# EAGLE schematic 8w_usb_soldering_iron (EAGLE 7.5.0)
CNAME: USB 8W Soldering Iron; CREVISION: 1.0; DESIGNER: RE by drubicza
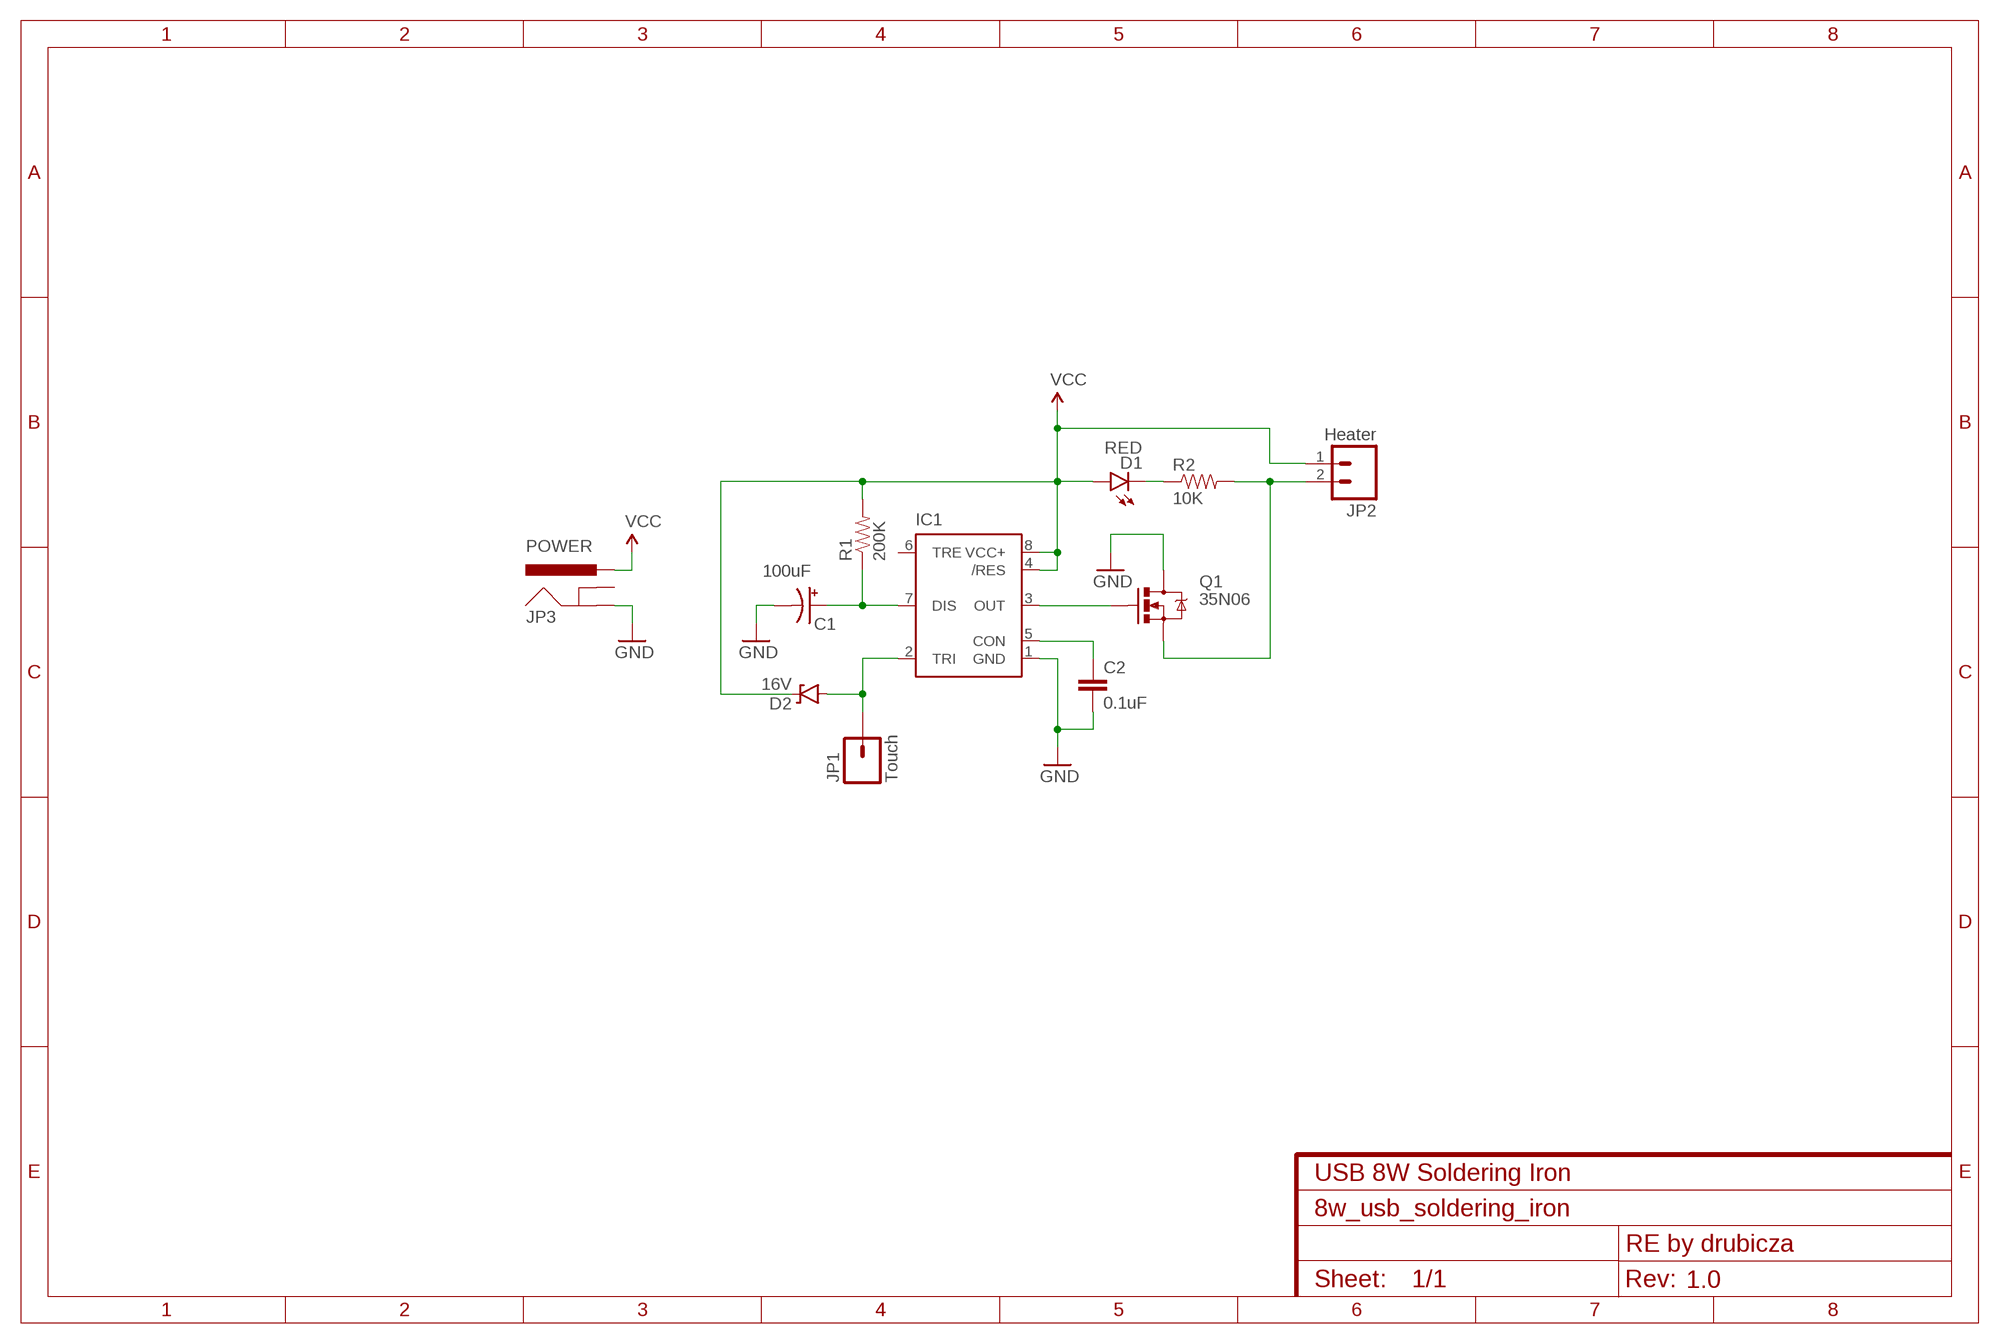
[diagram p0: schematic, sheet 1]

## Parts
C1  100uF  CAP_POLPTH1  [CPOL-RADIAL-100UF-25V]
C2  0.1uF  CAP0805  [0805]
D1  RED  LED3MM  [LED3MM]
D2  16V  DIODE-ZENER16V  [SOD-123]
IC1  NE555D  [SO08]
JP1  Touch  M01PTH  [1X01]
JP2  Heater  M02PTH  [1X02]
JP3  POWER  POWER_JACKPTH  [POWER_JACK_PTH]
Q1  35N06  MOSFET-NCHANNELFQP30N06L  [TO220V]
R1  200K  RESISTOR0603-RES  [0603-RES]
R2  10K  RESISTOR0603-RES  [0603-RES]

## Nets
GND: C1.2(-) C2.2 IC1.1(GND) JP3.GND Q1.2(D)
N$1: IC1.3(OUT) Q1.1(G)
N$2: C1.1(+) IC1.7(DIS) R1.1
N$3: D1.K(C) R2.1
N$4: C2.1 IC1.5(CON)
N$5: JP2.2 Q1.3(S) R2.2
N$7: D2.A IC1.2(TRI) JP1.1
VCC: D1.A D2.C IC1.4(/RES) IC1.8(VCC+) JP2.1 JP3.PWR R1.2
Unconnected: IC1.6(TRE) JP3.GNDBREAK

## Library data of the parts
C1 = SparkFun-Passives:CAP_POL: Capacitor Polarized These are standard SMD and PTH capacitors. Normally 10uF, 47uF, and 100uF in electrolytic and tantalum varieties. Always verify the external diameter of the through hole cap, it varies with capacity, voltage, and manufacturer. The EIA devices should be standard.
C2 = SparkFun-Passives:CAP: Capacitor Standard 0603 ceramic capacitor, and 0.1" leaded capacitor.
D1 = SparkFun-LED:LED: LEDs Standard schematic elements and footprints for 5mm, 3mm, 1206, and 0603 sized LEDs. 5mm - Spark Fun Electronics SKU : COM-00529 (and others)
D2 = SparkFun-DiscreteSemi:DIODE-ZENER: Zener Diode Production Part - 8199 3.4V Zener Voltage; PROD_ID: DIO-12440
IC1 = SparkFun-AnalogIC:NE555: General purpose bipolar Timer
JP1 = SparkFun-Connectors:M01: Header 1 Standard 1-pin 0.1" header. Use with straight break away headers (SKU : PRT-00116), right angle break away headers (PRT-00553), swiss pins (PRT-00743), machine pins (PRT-00117), and female headers (PRT-00115).
JP2 = SparkFun-Connectors:M02: Standard 2-pin 0.1" header. Use with - straight break away headers ( PRT-00116) - right angle break away headers (PRT-00553) - swiss pins (PRT-00743) - machine pins (PRT-00117) - female headers (PRT-00115) Molex polarized connector foot print use with: PRT-08233 with associated crimp pins and housings. 2.54_SCREWTERM for use with PRT-10571. 3.5mm Screw Terminal footprints for PRT-08084 5mm Screw Terminal footprints for use with PRT-08432
JP3 = SparkFun-Connectors:POWER_JACK: Power Jack This is the standard 5.5mm barrel jack for power. The PTH is the most common, proven, reliable, footprint. The Slot footprint only works if the mill layer is transmitted to the PCB fab house so be warned. Mating wall wart : TOL-00298 (and others); PROD_ID: CONN-08197
Q1 = SparkFun-DiscreteSemi:MOSFET-NCHANNEL: Common NMOSFET Parts MFG P/N Store ID Prod ID FDD8780 TRANS-09984 SI7820DN TRANS-11055 FDS6630A IC-08089 2N7002PW TRANS-11151 FQP30N06L COM-10213 TRANS-10060 BSS123LT1G TRANS-08345 BSS138 TRANS-00830 BS170 2N7000; PROD_ID: TRANS-10060
R1 R2 = SparkFun-Passives:RESISTOR: Resistor Basic schematic elements and footprints for 0603, 1206, and PTH resistors.